# EAGLE schematic Panelize - Xonik Noise A6 w.logo v2.0 (EAGLE 9.5.2)
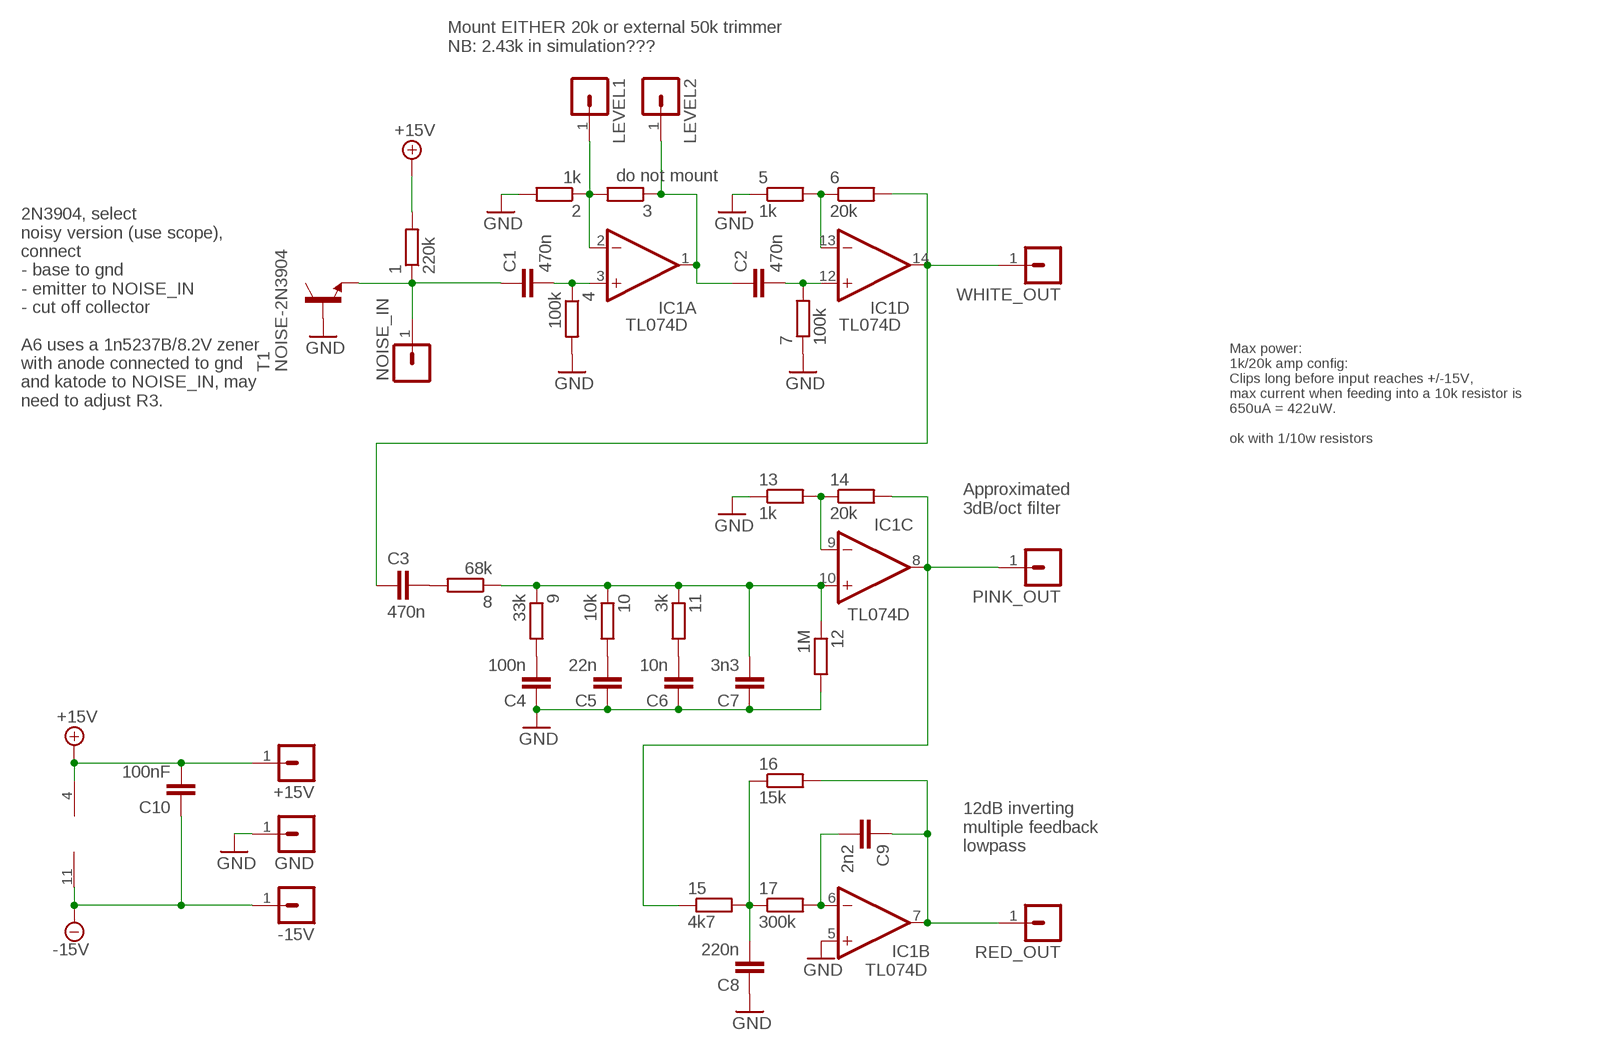
[diagram p0: schematic, sheet 1]

## Parts
1  220k  R-EU_R0805  [R0805]
2  1k  R-EU_R0805  [R0805]
3  do not mount  R-EU_R0805  [R0805]
4  100k  R-EU_R0805  [R0805]
5  1k  R-EU_R0805  [R0805]
6  20k  R-EU_R0805  [R0805]
7  100k  R-EU_R0805  [R0805]
8  68k  R-EU_R0805  [R0805]
9  33k  R-EU_R0805  [R0805]
10  10k  R-EU_R0805  [R0805]
11  3k  R-EU_R0805  [R0805]
12  1M  R-EU_R0805  [R0805]
13  1k  R-EU_R0805  [R0805]
14  20k  R-EU_R0805  [R0805]
15  4k7  R-EU_R0805  [R0805]
16  15k  R-EU_R0805  [R0805]
17  300k  R-EU_R0805  [R0805]
+15V  MA01-1JP  [SIP-PIN01-1J]
-15V  MA01-1JP  [SIP-PIN01-1J]
C1  470n  C-EUC0805  [C0805]
C2  470n  C-EUC0805  [C0805]
C3  470n  C-EUC0805  [C0805]
C4  100n  C-EUC0805  [C0805]
C5  22n  C-EUC0805  [C0805]
C6  10n  C-EUC0805  [C0805]
C7  3n3  C-EUC0805  [C0805]
C8  220n  C-EUC0805  [C0805]
C9  2n2  C-EUC0805  [C0805]
C10  100nF  C-EUC0603  [C0603]
GND  MA01-1JP  [SIP-PIN01-1J]
IC1  TL074D  [SO14]
LEVEL1  MA01-1JP  [SIP-PIN01-1J]
LEVEL2  MA01-1JP  [SIP-PIN01-1J]
NOISE_IN  MA01-1JP  [SIP-PIN01-1J]
PINK_OUT  MA01-1JP  [SIP-PIN01-1J]
RED_OUT  MA01-1JP  [SIP-PIN01-1J]
T1  NOISE-2N3904  [NOISE-2N3904-J]
WHITE_OUT  MA01-1JP  [SIP-PIN01-1J]

## Nets
+15V: 1.2 +15V.1 C10.2 IC1.4(P:V+)
-15V: -15V.1 C10.1 IC1.11(P:V-)
GND: 2.2 4.2 5.1 7.1 12.2 13.1 C4.1 C5.1 C6.1 C7.1 C8.1 GND.1 IC1.5(B:+IN) T1.B
N$1: 2.1 3.2 IC1.2(A:-IN) LEVEL1.1
N$2: 5.2 6.1 IC1.13(D:-IN)
N$3: 13.2 14.1 IC1.9(C:-IN)
N$4: 9.2 C4.2
N$5: 10.2 C5.2
N$6: 11.2 C6.2
N$7: 1.1 C1.1 NOISE_IN.1 T1.E
N$8: 4.1 C1.2 IC1.3(A:+IN)
N$9: 3.1 C2.1 IC1.1(A:OUT) LEVEL2.1
N$10: 7.2 C2.2 IC1.12(D:+IN)
N$11: 6.2 C3.1 IC1.14(D:OUT) WHITE_OUT.1
N$12: 8.1 9.1 10.1 11.1 12.1 C7.2 IC1.10(C:+IN)
N$13: 8.2 C3.2
N$14: 14.2 15.1 IC1.8(C:OUT) PINK_OUT.1
N$16: 15.2 16.1 17.1 C8.2
N$17: 17.2 C9.2 IC1.6(B:-IN)
N$18: 16.2 C9.1 IC1.7(B:OUT) RED_OUT.1

## Notes on the sheet
- Mount EITHER 20k or external 50k trimmer
  NB: 2.43k in simulation???
- 2N3904, select
  noisy version (use scope),
  connect 
  - base to gnd
  - emitter to NOISE_IN
  - cut off collector
  
  A6 uses a 1n5237B/8.2V zener
  with anode connected to gnd 
  and katode to NOISE_IN, may
  need to adjust R3.
- Max power:
  1k/20k amp config:
  Clips long before input reaches +/-15V,
  max current when feeding into a 10k resistor is
  650uA = 422uW. 
  
  ok with 1/10w resistors
- Approximated
  3dB/oct filter
- 12dB inverting
  multiple feedback
  lowpass

## Library data of the parts
1-17 = resistor:R-EU_: RESISTOR, European symbol
+15V -15V GND LEVEL1 LEVEL2 NOISE_IN PINK_OUT RED_OUT WHITE_OUT = joakim:MA01-1J: PIN HEADER
C1-C10 = resistor:C-EU: CAPACITOR, European symbol
IC1 = linear:TL074: OP AMP
T1 = joakim:NOISE-2N3904: 2N3904 with the collector cut, used as a noise source